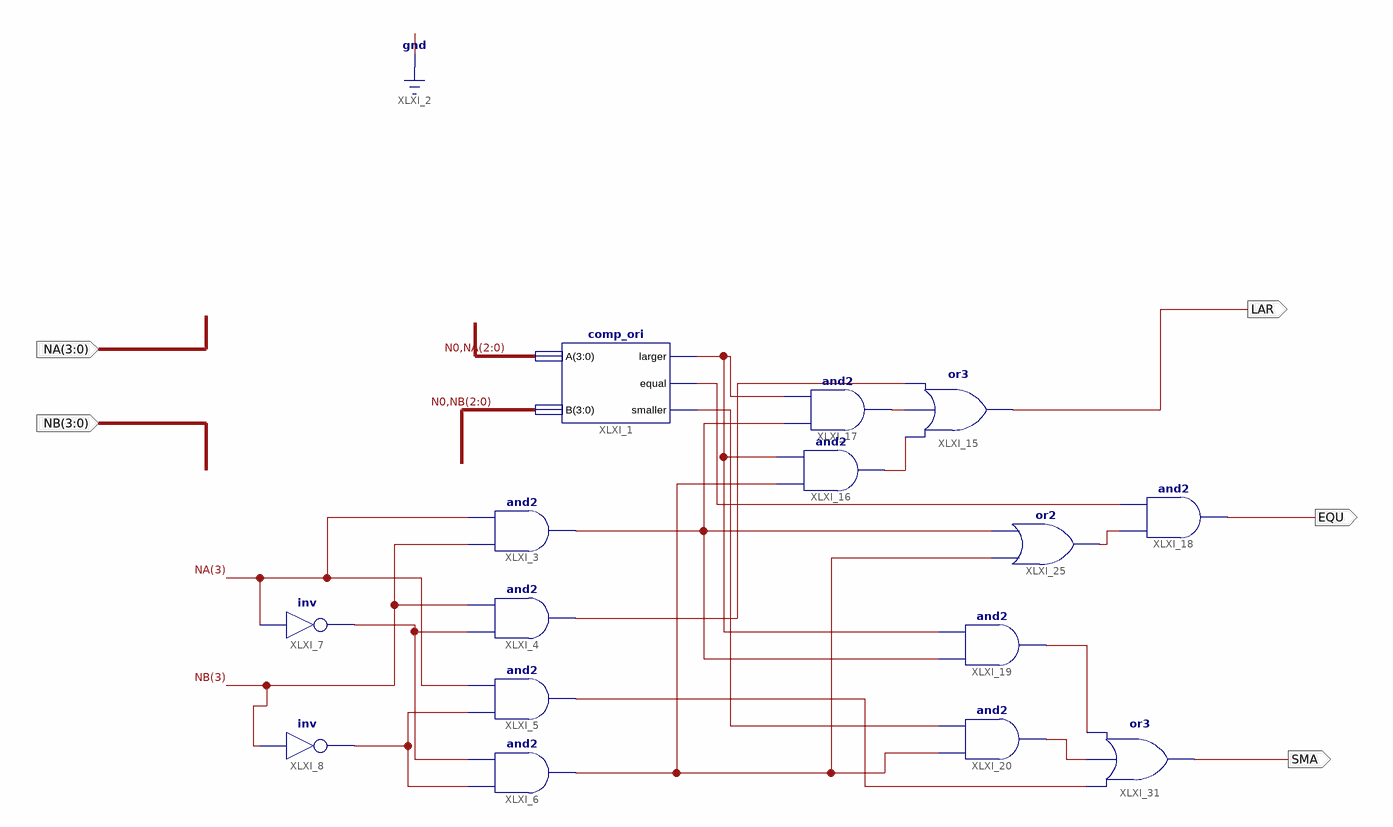
[diagram p0: schematic sheet 1]
// Xilinx ISE schematic compare.sch (kintex7) as structural Verilog: 15 symbols, 5 ports
module compare (
  input  [3:0] NA,
  input  [3:0] NB,
  output LAR,
  output EQU,
  output SMA
);

  wire XLXN_19, XLXN_20, XLXN_35, XLXN_36, XLXN_37, XLXN_38, XLXN_40, XLXN_41, XLXN_43, XLXN_44, XLXN_58,
       XLXN_59, XLXN_60, XLXN_61;

  comp_ori XLXI_1 (.A({1'b0, NA[2:0]}), .B({1'b0, NB[2:0]}), .larger(XLXN_37), .equal(XLXN_43), .smaller(XLXN_61));
  and XLXI_3 (XLXN_40, NB[3], NA[3]);
  and XLXI_4 (XLXN_35, XLXN_19, NB[3]);
  and XLXI_5 (XLXN_58, XLXN_20, NA[3]);
  and XLXI_6 (XLXN_36, XLXN_20, XLXN_19);
  not XLXI_7 (XLXN_19, NA[3]);
  not XLXI_8 (XLXN_20, NB[3]);
  or XLXI_15 (LAR, XLXN_41, XLXN_38, XLXN_35);
  and XLXI_16 (XLXN_41, XLXN_36, XLXN_37);
  and XLXI_17 (XLXN_38, XLXN_40, XLXN_37);
  and XLXI_18 (EQU, XLXN_44, XLXN_43);
  or XLXI_25 (XLXN_44, XLXN_36, XLXN_40);
  and XLXI_19 (XLXN_60, XLXN_40, XLXN_37);
  and XLXI_20 (XLXN_59, XLXN_36, XLXN_61);
  or XLXI_31 (SMA, XLXN_58, XLXN_59, XLXN_60);
endmodule
